# Altium project PCEIOT - V1.1.0.PrjPcb (part 2 of 2)

## Sheet [7] PowerManagement.SchDoc: =DocumentName
size A3; ENG_APP_DATE: --/--/--; DSN_APP_DATE: --/--/--; CHK_APP_DATE: --/--/--; Organization: ORGANIZATION; Address1: R. Aprígio Veloso, 882, Universitário; Address2: Campina Grande - PB; Address3: 58429-900; DocumentNumber: 7; Revision: -; SheetNumber: 7; SheetTotal: 9; Project: PCEIOT - V1.1.0.PrjPcb; ENG_DATE: --/--/--; DSN_DATE: --/--/--; CHK_DATE: --/--/--; SCH_SCALE: 1:1
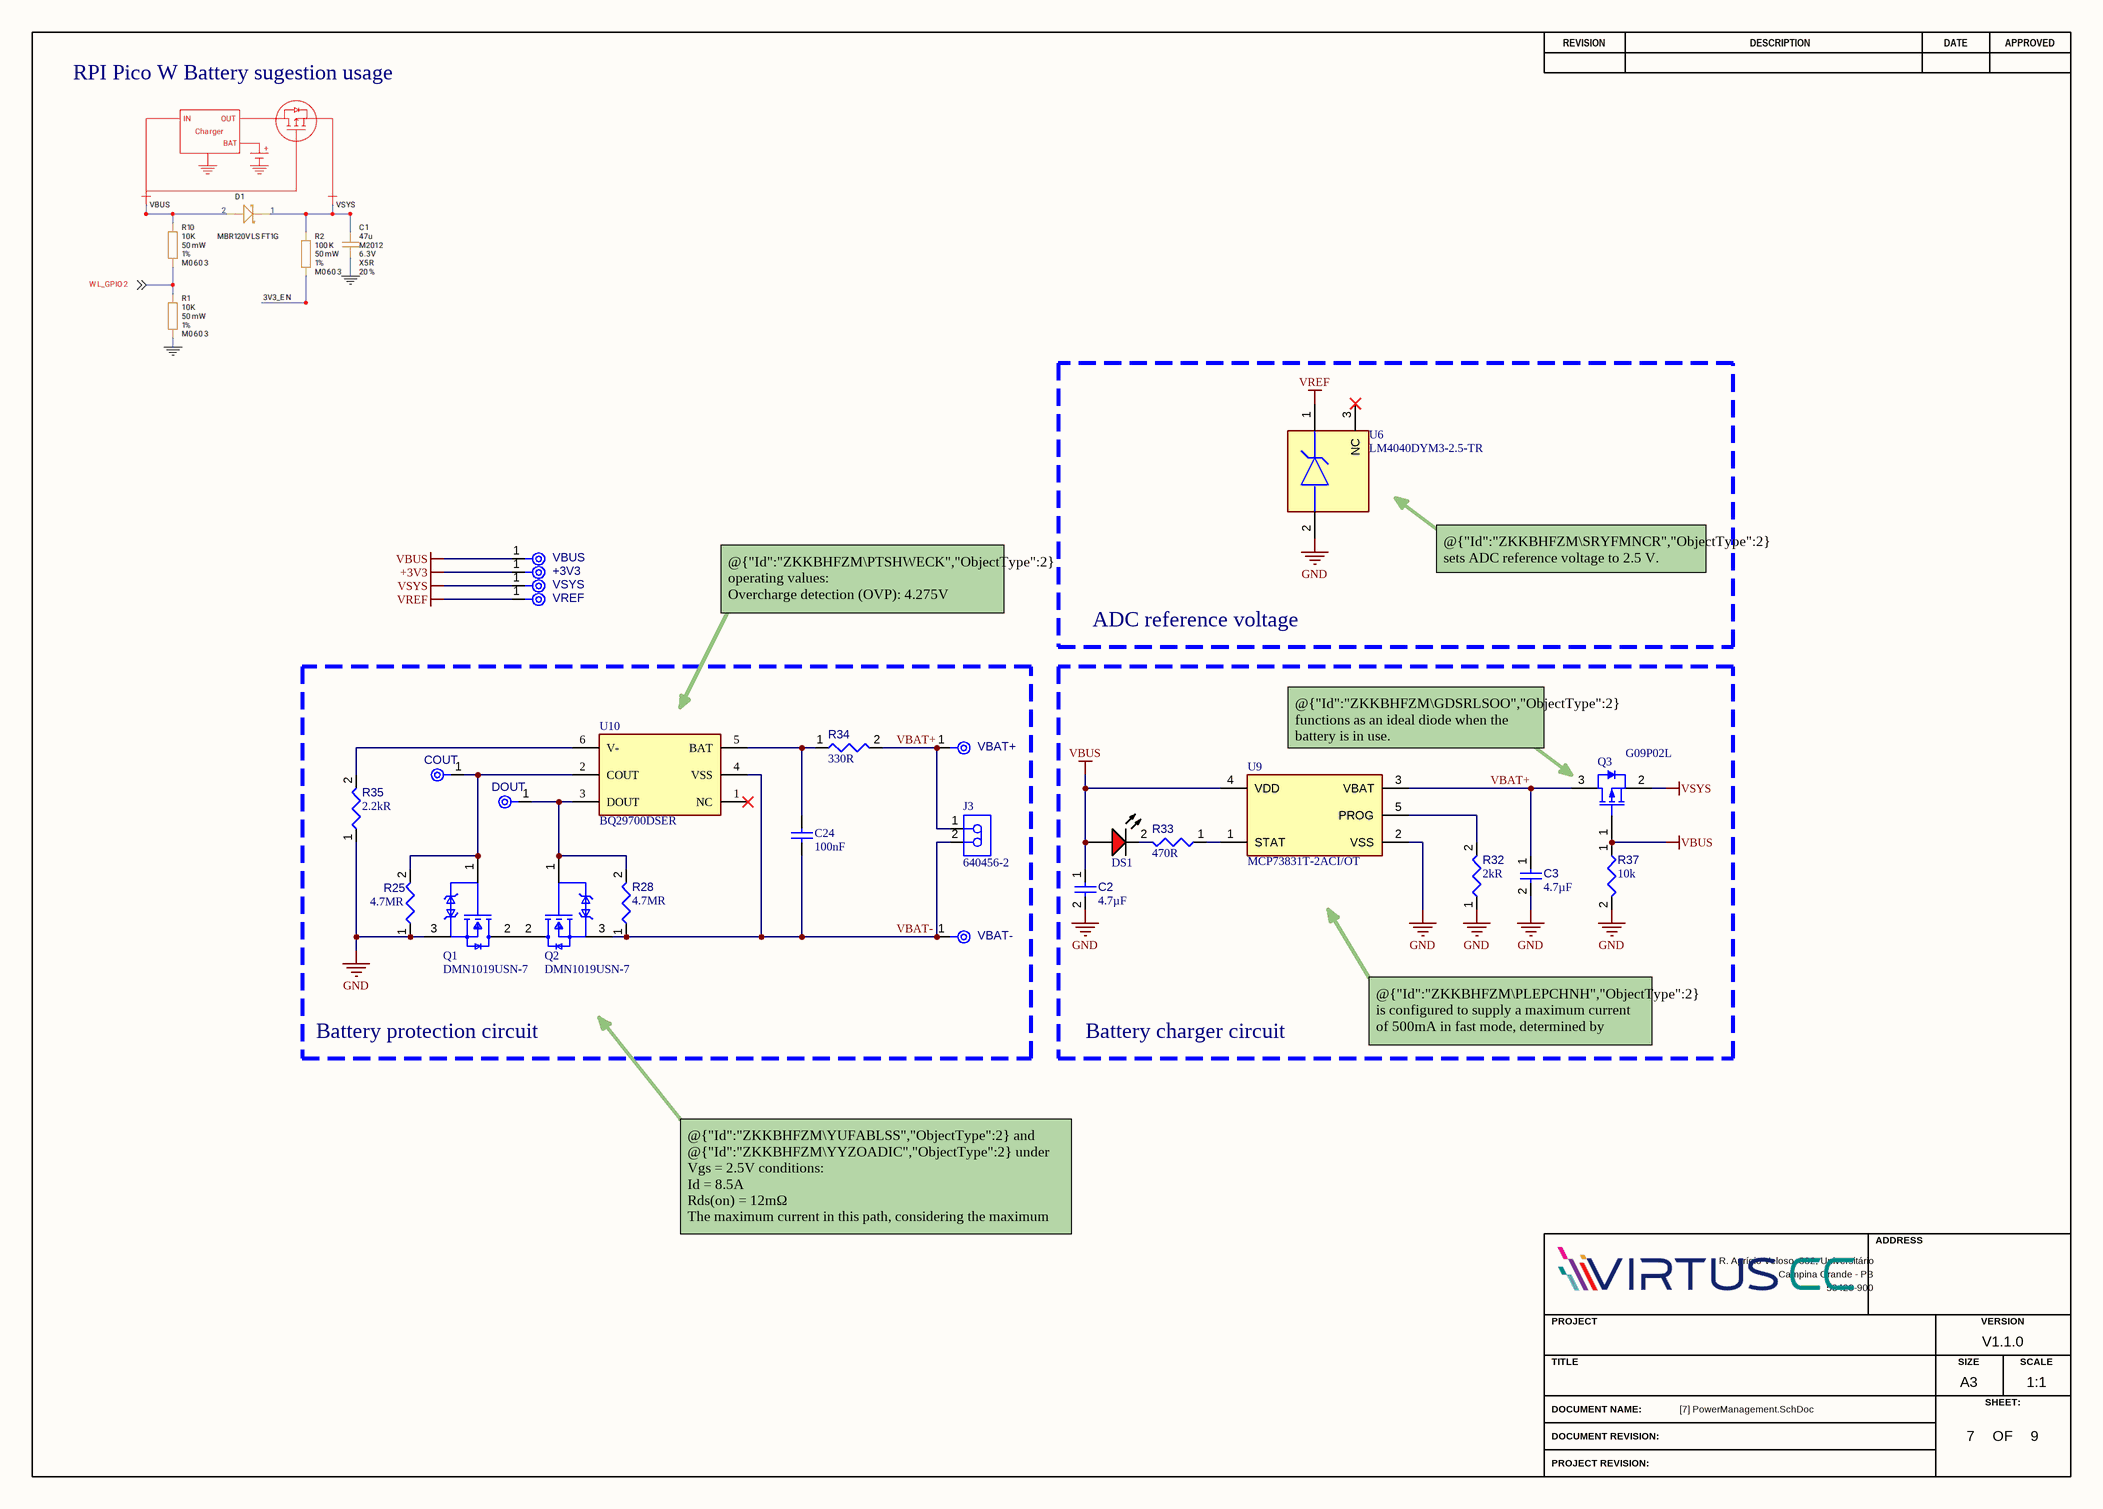
[diagram p5: [7] PowerManagement.SchDoc]

### Parts
+3V3  TPAD6R  [TP06R]  (value not drawn)  (no BOM)
C2  value 4.7µF  [CAPC0603(1608)100_L]  (hidden comment: Capacitor 4.7µF +/-20% 10V 0603)
C3  value 4.7µF  [CAPC0603(1608)100_L]  (hidden comment: Capacitor 4.7µF +/-20% 10V 0603)
C24  value 100nF  [CAPC0603(1608)100_L]  (hidden comment: VJ0603Y104MXJCW1BC)
COUT  TPAD6R  [TP06R]  (value not drawn)  (no BOM)
DOUT  TPAD6R  [TP06R]  (value not drawn)  (no BOM)
DS1  19-217/R6C-AL1M2VY/3T  [EVRL-0603-2_V]  (value not drawn)
J3  640456-2  [TECO-640456-2_V]
Q1  DMN1019USN-7  [FP-SC59-MFG]
Q2  DMN1019USN-7  [FP-SC59-MFG]
Q3  G09P02L  [G09P02L]
R25  value 4.7MR  [RESC0603(1608)_L]  (hidden comment: ERJ-3GEYJ475V)
R28  value 4.7MR  [RESC0603(1608)_L]  (hidden comment: ERJ-3GEYJ475V)
R32  value 2kR  [RESC0603(1608)_L]  (hidden comment: ERJ-3EKF2001V)
R33  value 470R  [RESC0603(1608)_L]  (hidden comment: CRCW0603470RJNEA)
R34  value 330R  [RESC0603(1608)_L]  (hidden comment: ERJ-3EKF3300V)
R35  value 2.2kR  [RESC0603(1608)_L]  (hidden comment: CRCW06032K20FKEA)
R37  value 10k  [RESC0603(1608)_L]  (hidden comment: Resistor 10k +/-1% 0603 100 mW)
U6  LM4040DYM3-2.5-TR  [FP-SOT23-3LD-PL-1-IPC_A]
U9  MCP73831T-2ACI/OT  [FP-C04-091-OT-MFG]
U10  BQ29700DSER  [FP-DSE0006A-MFG]
VBAT+  TPAD6R  [TP06R]  (value not drawn)  (no BOM)
VBAT-  TPAD6R  [TP06R]  (value not drawn)  (no BOM)
VBUS  TPAD6R  [TP06R]  (value not drawn)  (no BOM)
VREF  TPAD6R  [TP06R]  (value not drawn)  (no BOM)
VSYS  TPAD6R  [TP06R]  (value not drawn)  (no BOM)

### Blocks framed on the sheet
ADC reference voltage: U6
Battery protection circuit: C24 COUT DOUT J3 Q1 Q2 R25 R28 R34 R35 U10 VBAT+ VBAT-
Battery charger circuit: C2 C3 DS1 Q3 R32 R33 R37 U9

### Nets
+3V3: +3V3.1(TP)
GND: C2.2 C3.2 Q1.3(D) R25.1 R32.1 R35.1 R37.2 U6.2(-) U9.2(VSS)
VBUS: C2.1 DS1.1(A) Q3.1(G) R37.1 U9.4(VDD) VBUS.1(TP)
VREF: U6.1(+) VREF.1(TP)
VSYS: Q3.2(S) VSYS.1(TP)
VBAT+: C3.1 J3.1 Q3.3(D) R34.2 U9.3(VBAT) VBAT+.1(TP)
VBAT-: C24.1 J3.2 Q2.3(D) R28.1 U10.4(VSS) VBAT-.1(TP)
NetC24_2: C24.2 R34.1 U10.5(BAT)
NetCOUT_1: COUT.1(TP) Q1.1(G) R25.2 U10.2(COUT)
NetDOUT_1: DOUT.1(TP) Q2.1(G) R28.2 U10.3(DOUT)
NetDS1_2: DS1.2(K) R33.2
NetQ1_2: Q1.2(S) Q2.2(S)
NetR32_2: R32.2 U9.5(PROG)
NetR33_1: R33.1 U9.1(STAT)
NetR35_2: R35.2 U10.6(V-)

Not connected (* = marked no-connect by the designer): U6 3(NC)*; U10 1(NC)*

### Notes on the sheet
- RPI Pico W Battery sugestion usage
- @{"Id":"ZKKBHFZM\SRYFMNCR","ObjectType":2} sets ADC reference voltage to 2.5 V.
- @{"Id":"ZKKBHFZM\PTSHWECK","ObjectType":2} operating values:
  Overcharge detection (OVP): 4.275V
  Over-discharge detection (UVP): 2.800V
- (near U9) @{"Id":"ZKKBHFZM\GDSRLSOO","ObjectType":2} functions as an ideal diode when the battery is in use.
- @{"Id":"ZKKBHFZM\PLEPCHNH","ObjectType":2} is configured to supply a maximum current of 500mA in fast mode, determined by @{"Id":"ZKKBHFZM\ESMCSCBA","ObjectType":2}.
- @{"Id":"ZKKBHFZM\YUFABLSS","ObjectType":2} and @{"Id":"ZKKBHFZM\YYZOADIC","ObjectType":2} under Vgs = 2.5V conditions:
  Id = 8.5A
  Rds(on) = 12mΩ
  The maximum current in this path, considering the maximum power output of the DC-DC converter in the Raspberry Pi Pico W, is approximately 3.6A.
- REVISION
- DESCRIPTION
- DATE
- APPROVED
- ADDRESS
- PROJECT
- VERSION
- TITLE
- A3
- SIZE
- SCALE
- DOCUMENT NAME:
- DOCUMENT REVISION:
- OF
- SHEET:
- PROJECT REVISION:

### Library data of the parts
+3V3 COUT DOUT VBAT+ VBAT- VBUS VREF VSYS = CMP-00028-00002-2: 0.6mm round; Pins: 1
C2 C3 = CMP-001-00076-4: Chip Capacitor, 4.7µF +/-20%, 10V, 0603, Thickness 1 mm; Tolerance: 10%; Mounting Technology: SMT; Case/Package: 0603; Pins: 2; Min Operating Temperature: -55°C; Max Operating Temperature: 85°C; Voltage Rating: 10V
C24 = CMP-001-00085-1: Multilayer Ceramic Capacitor, 0.1 uF, 16 V, ± 20%, X7R, 0603 [1608 Metric]; Dielectric Material: Tantalum; Voltage Rating: 16V; Packaging: Tape and Reel; Min Operating Temperature: -55°C; Case/Package: 0603; Length: 1.6mm; Termination: SMD/SMT; Height: 0.95mm; Mounting Technology: Surface Mount; Width: 0.8mm; Case Code (Imperial): 0603; Construction: Flat; Lead Free: Lead Free; Package Quantity: 4000; Max Operating Temperature: 125°C; Dielectric: X7R; RoHS Compliant: Yes; Depth: 0.8mm; Tolerance: 20%; Series: VJ; Case Code (Metric): 1608; Voltage Rating (DC): 16V
DS1 = CMP-007-00004-2: Chip LED, Red, 5 V, 25 mA, -40 to 85 degC, 2-Pin SMD (0603), RoHS, Tape and Reel; Manufacturer: Everlight Electronics; Forward Voltage: 2.2V; Lens Style: Clear; Package Reference: 0603; Datasheet Version: Rev. 1, 01/2005; Mounting Technology: SM; RoHS Compliant: False; Datasheet URL: https://datasheet.ciiva.com/4688/el-19-217-r6c-al1m2vy-3tpdf-187026-4688713.pdf; Case/Package: 0603; Colour: Red; Manufacturer URL: http://www.everlight.com/; Package Description: 2-Pin Surface Mount Device, Body 1.6 x 0.8 mm
J3 = CMP-002-00073-1: Connector 250V AC/DC 5A 2P 1 Row PCB - Vertical Mounting Polyester White; Contact Retention: No (Without); PCB Thickness: 0.063inch; Approvals: CSA; Contact Post Length: 3.56mm; Gender: Male; Circuit Application: Signal; Tail Length: 0.14inch; Plating Thickness: 3.81um; Plating: Tin; Mating Connector Lock: Yes (With); PCB Mount Retention: Without; Contact Style: Straight; Number of Positions: 2; Connector System: Wire-to-Board; Pitch: 2.54mm; Connector Type: Connector,Pin,Plug,Header; Voltage Rating: 250V; Termination: Solder; Contact Current Rating: 5A; PCB Mount Alignment: No (Without); Housing Material: Polyester; Contact Material: Copper Alloy; Current Rating: 5A; Mounting Ears: No (Without); Strain Relief: No (Without); Shrouded: No (Without); Min Operating Temperature: -67°C; Orientation: Straight; Series: MTA-100; Panel Mount Retention: No (Without); Package Quantity: 5000; Height: 7.87mm; Length: 7.62mm; PCB Mounting Orientation: Vertical; Flammability Rating: UL94 V-0; Operating Supply Voltage: 250V; Contact Plating: Tin; Mounting Technology: Through Hole; Voltage Rating (AC): 250V; Backwall/Post Interruptions: No (Without); Contact Mating Length: 7.49mm; Color: Beige; Voltage Rating (DC): 250V; Lead Free: Lead Free; Reach SVHC Compliant: Unknown; Sealable: No (Without); Mating Alignment: No (Without); Mating Retention: No (Without); Number of Contacts: 2; Contact Shape: Square; Max Operating Temperature: 221°C; Number of Rows: 1; RoHS Compliant: Yes; Housing Color: Natural
Q1 Q2 = CMP-013-00035-1: N-Channel 12 V 10 mO 50.6 nC SMT Enhancement Mode Mosfet - SC-59 (SOT-23); Gate to Source Voltage (Vgs): 4.5V; Max Power Dissipation: 680mW; Number of Channels: 1; Rds On Max: 10mR; Input Capacitance: 2.426nF; Turn-On Delay Time: 7.6ns; Value: 2.426E-09F; Rise Time: 57.6ns; Fall Time: 16.8ns; Drain to Source Resistance: 41mR; Turn-Off Delay Time: 22.2ns; Continuous Drain Current (ID): 9.3A; Drain to Source Voltage (Vdss): 12V; RoHS Compliant: Yes; Min Operating Temperature: -55°C; Series: -; Max Operating Temperature: 150°C; Lead Free: Lead Free; Weight: 0.000282oz; Package Quantity: 3000; Polarity: N-CHANNEL; Packaging: Tape and Reel; Case/Package: TO-236-3; Mounting Technology: Surface Mount
Q3 = CMP-013-00036-1: P-Channel Enhancement Mode Power MOSFET; Rds On (Max) @ Id, Vgs: 20mOhm @ 1A, 4.5V; Drain to Source Voltage (Vdss): 20 V; Vgs (Max): ±12V; Drive Voltage (Max Rds On, Min Rds On): 2.5V, 4.5V; Current - Continuous Drain (Id) @ 25°C: 9A (Tc); FET Type: P-Channel
R25 R28 = CMP-009-00185-1: Res Thick Film 0603 4.7M Ohm 5% 0.1W -400ppm/°C to 150ppm/°C Molded SMD Punched Carrier T/R; Voltage Rating (DC): 50V; Max Power Dissipation: 100mW; Voltage Rating: 75V; Min Operating Temperature: -55°C; Reach SVHC Compliant: Unknown; Resistance Tolerance: 5%; Contact Plating: Tin; Military Standard: Not; RoHS Compliant: Yes; Tolerance: 5%; Depth: 0.8mm; Case/Package: 0603; Number of Terminations: 2; Width: 0.8mm; Lead Free: Lead Free; Case Code (Metric): 1608; Construction: Rectangular; Series: ERJ; Features: Automotive AEC-Q200; Length: 1.6mm; Power Rating: 100mW; Weight: 7.1E-05oz; Termination: SMD/SMT; Height: 0.45mm; Resistor Type: Thick Film; Case Code (Imperial): 0603; Packaging: Tape and Reel; Mounting Technology: Surface Mount; Temperature Coefficient: 150ppm/°C; Package Quantity: 1; Technology: THICK FILM; Max Operating Temperature: 155°C
R32 = CMP-009-00181-1: SMD Chip Resistor, 2 kOhm, ï¿½ 1%, 100 mW, 0603 [1608 Metric], Thick Film, Precision; Power Rating: 100mW; Temperature Coefficient: 100ppm/°C; Voltage Rating: 75V; Voltage Rating (DC): 50V; Construction: Rectangular; Tolerance: 1%; Case Code (Imperial): 0603; Contact Plating: Tin; Packaging: Tape and Reel; Width: 0.8mm; Length: 1.6mm; Lead Free: Lead Free; Max Operating Temperature: 155°C; Number of Terminations: 2; Features: Automotive AEC-Q200; Min Operating Temperature: -55°C; Termination: SMD/SMT; Case/Package: 0603; Max Power Dissipation: 100mW; Reach SVHC Compliant: No; Radiation Hardening: No; RoHS Compliant: Yes; Resistance Tolerance: 1%; Pins: 2; Series: ERJ; Case Code (Metric): 1608; Mounting Technology: Surface Mount; Height: 0.022inch; Military Standard: Not; Depth: 0.8mm; Package Quantity: 1; Resistor Type: Thick Film
R33 = CMP-009-00182-1: Res Thick Film 0603 470 Ohm 5% 0.1W(1/10W) ±200ppm/°C Pad SMD Automotive T/R; Max Power Dissipation: 100mW; Working Voltage: 75V; Case Code (Metric): 1608; Case Code (Imperial): 0603; Width: 0.85mm; Series: CRCW; Max Operating Temperature: 155°C; Features: Automotive AEC-Q200; Height: 0.45mm; Technology: THICK FILM; Power Rating: 100mW; Depth: 0.85mm; Min Operating Temperature: -55°C; Weight: 7.1E-05oz; RoHS Compliant: Yes; Number of Terminations: 2; Voltage Rating: 75V; Ratings: AEC-Q200; Case/Package: 0603; Contact Plating: Tin; Radiation Hardening: No; Termination: SMD/SMT; Tolerance: 5%; Construction: Rectangular; Package Quantity: 5000; Reach SVHC Compliant: Unknown; Length: 1.55mm; Resistor Type: Thick Film; Lead Free: Lead Free; Temperature Coefficient: 200ppm/°C; Resistance Tolerance: 5%; Packaging: Tape and Reel; Military Standard: Not
R34 = CMP-009-00184-1: SMD Chip Resistor, 330 Ohm, ± 1%, 100 mW, 0603 [1608 Metric], Thick Film, Precision; Current Rating: 500mA; Voltage Rating (DC): 75V; Power Rating: 100mW; Gender: Male; Temperature Coefficient: 100ppm/°C; Termination: SMD/SMT; Construction: Rectangular; Contact Plating: Tin; Resistor Type: Thick Film; Features: Automotive AEC-Q200; Max Operating Temperature: 155°C; Weight: 7.1E-05oz; Package Quantity: 5000; Lead Pitch: 1.1mm; Radiation Hardening: No; Lead Free: Lead Free; Min Operating Temperature: -55°C; Reach SVHC Compliant: No; Pins: 2; Number of Terminations: 2; Width: 0.8mm; RoHS Compliant: Yes; Depth: 0.8mm; Packaging: Tape and Reel; Voltage Rating: 75V; Mounting Technology: Surface Mount; Case Code (Metric): 1608; Resistance Tolerance: 1%; Tolerance: 1%; Case Code (Imperial): 0603; Length: 1.6mm; Height: 0.45mm; Military Standard: Not; Series: ERJ; Max Power Dissipation: 100mW; Case/Package: 0603; Contact Material: Copper
R35 = CMP-009-00186-1: SMD Chip Resistor, 2.2 kOhm, ± 1%, 100 mW, 0603 [1608 Metric], Thick Film, General Purpose; Voltage Rating (DC): 75V; Max Power Dissipation: 100mW; Temperature Coefficient: 100ppm/°C; Depth: 0.85mm; Height: 0.45mm; Contact Plating: Tin; Resistance Tolerance: 1%; Ratings: AEC-Q200; Weight: 7.1E-05oz; Series: CRCW; Case Code (Imperial): 0603; Construction: Rectangular; Width: 0.033inch; Reach SVHC Compliant: Unknown; Case Code (Metric): 1608; Resistor Type: Thick Film; Packaging: Tape and Reel; Case/Package: 0603; Package Quantity: 10; RoHS Compliant: Yes; Lead Free: Lead Free; Military Standard: Not; Termination: SMD/SMT; Tolerance: 1%; Technology: THICK FILM; Max Operating Temperature: 155°C; Voltage Rating: 75V; Power Rating: 100mW; Length: 1.55mm; Number of Terminations: 2; Radiation Hardening: No; Min Operating Temperature: -55°C; Features: Automotive AEC-Q200
R37 = CMP-009-00017-7: Chip Resistor, 10 KOhm, +/- 1%, 01 W, -55 to 155 degC, 0603 (1608 Metric); Voltage Rating: 50V; Power: 100mW; RoHS Compliant: True; Min Operating Temperature: -55°C; Pins: 2; Case/Package: 0603; Mounting Technology: SM; Max Operating Temperature: 155°C; Tolerance: 1%
U6 = CMP-004-00033-1: LM4040 Series 2.5 V ±1 % Precision Micropower Shunt Voltage Reference - SOT-23; Output Type: Fixed; Output Voltage: 10V; Max Output Voltage: 2.5V; Cathode Current: 70uA; Temperature Coefficient: 150ppm/°C; Output Current: 15mA; Tolerance: 1%; Supply Current: 500nA; Height: 1.01mm; Reference Type: Shunt; Lead Free: Lead Free; Max Operating Temperature: 85°C; Series: -; Min Output Voltage: 2.5V; Length: 2.92mm; Current Rating: 15mA; Pins: 3; Package Quantity: 3000; Max Output current: 15mA; Min Operating Temperature: -40°C; Packaging: Tape and Reel; Width: 1.3mm; Radiation Hardening: No; Case/Package: SOT-23; Reach SVHC Compliant: No; Reference Voltage: 2.5V; RoHS Compliant: Yes; Mounting Technology: Surface Mount
U9 = CMP-001-0001-1: MCP73831 Series Single-Cell Li-Ion/Li-Polymer Battery Charge Controller SOT-23-5; Output Voltage: 4.2V; Number of Channels: 1; Fault Protection: Over Voltage; Min Supply Voltage: 3.75V; Max Supply Voltage: 6V; Max Power Dissipation: 1.54W; Output Current: 500mA; Voltage Rating: 4.534V; Drain to Source Resistance: 350mR; Min Output Voltage: 4.168V; Max Output Voltage: 4.5V; Mounting Technology: Surface Mount; Number of Outputs: 1; RoHS Compliant: Yes; Weight: 0.00709oz; Length: 3.1mm; Max Operating Temperature: 85°C; Series: -; Case/Package: SOT-23; Radiation Hardening: No; Pins: 5; Packaging: Tape and Reel; Lead Free: Lead Free; Number of Cells: 1; Width: 1.8mm; Height: 1.3mm; Max Charge Current: 500mA; Battery Pack Voltage: 4.2V; Reach SVHC Compliant: No; Termination: SMD/SMT; Min Operating Temperature: -40°C
U10 = CMP-001-0002-1: Li-Ion/Li Polymer Advanced Single-Cell Battery Protector IC Family 6-WSON -40 to 85; Fault Protection: Over Current,Short Circuit,Over/Under Voltage; Operating Supply Voltage: 8V; Number of Cells: 1; Case/Package: WFDFN; Lead Free: Lead Free; Pins: 6; Height: 800um; Packaging: Tape and Reel; Max Operating Temperature: 85°C; Weight: 0.000342oz; Mounting Technology: Surface Mount; Series: -; Contact Plating: Gold; Thickness: 750um; RoHS Compliant: Yes; Package Quantity: 3000; Width: 1.5mm; Length: 1.5mm; Min Operating Temperature: -40°C

## Sheet [9] Mechanical.SchDoc: =DocumentName
size A3; ENG_APP_DATE: --/--/--; DSN_APP_DATE: --/--/--; CHK_APP_DATE: --/--/--; Organization: ORGANIZATION; Address1: R. Aprígio Veloso, 882, Universitário; Address2: Campina Grande - PB; Address3: 58429-900; DocumentNumber: 9; Revision: -; SheetNumber: 9; SheetTotal: 9; Project: PCEIOT - V1.1.0.PrjPcb; ENG_DATE: --/--/--; DSN_DATE: --/--/--; CHK_DATE: --/--/--; SCH_SCALE: 1:1
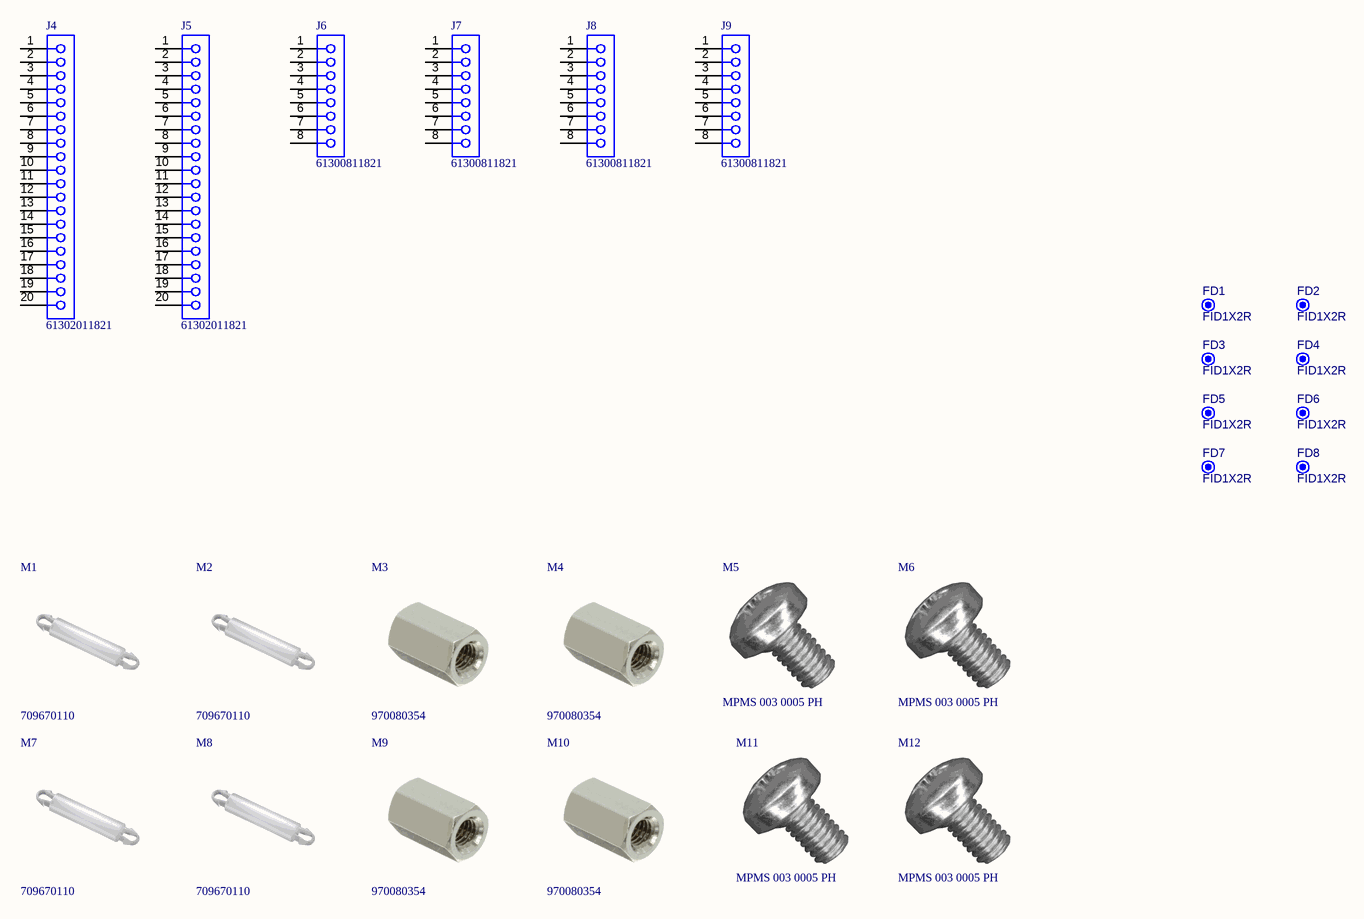
[diagram p6: [9] Mechanical.SchDoc]

### Parts
FD1  FID1X2R  [FID1X2R]  (no BOM)
FD2  FID1X2R  [FID1X2R]  (no BOM)
FD3  FID1X2R  [FID1X2R]  (no BOM)
FD4  FID1X2R  [FID1X2R]  (no BOM)
FD5  FID1X2R  [FID1X2R]  (no BOM)
FD6  FID1X2R  [FID1X2R]  (no BOM)
FD7  FID1X2R  [FID1X2R]  (no BOM)
FD8  FID1X2R  [FID1X2R]  (no BOM)
J4  61302011821  [61302011821]  (mechanical)
J5  61302011821  [61302011821]  (mechanical)
J6  61300811821  [61300811821]  (mechanical)
J7  61300811821  [61300811821]  (mechanical)
J8  61300811821  [61300811821]  (mechanical)
J9  61300811821  [61300811821]  (mechanical)
M1  709670110  (mechanical)
M2  709670110  (mechanical)
M3  970080354  (mechanical)
M4  970080354  (mechanical)
M5  MPMS 003 0005 PH  (mechanical)
M6  MPMS 003 0005 PH  (mechanical)
M7  709670110  (mechanical)
M8  709670110  (mechanical)
M9  970080354  (mechanical)
M10  970080354  (mechanical)
M11  MPMS 003 0005 PH  (mechanical)
M12  MPMS 003 0005 PH  (mechanical)

### Nets

Not connected (* = marked no-connect by the designer): J4 1 2 3 4 5 6 7 8 9 10 11 12 13 14 15 16 17 18 19 20; J5 1 2 3 4 5 6 7 8 9 10 11 12 13 14 15 16 17 18 19 20; J6 1 2 3 4 5 6 7 8; J7 1 2 3 4 5 6 7 8; J8 1 2 3 4 5 6 7 8; J9 1 2 3 4 5 6 7 8

### Notes on the sheet
- REVISION
- DESCRIPTION
- DATE
- APPROVED
- ADDRESS
- PROJECT
- VERSION
- TITLE
- A3
- SIZE
- SCALE
- DOCUMENT NAME:
- DOCUMENT REVISION:
- OF
- SHEET:
- PROJECT REVISION:

### Library data of the parts
FD1-FD8 = CMP-00028-00005-5: Fiducial - Round 1x2mm; Pins: 0
J4 J5 = CMP-002-00074-1: THT Vertical Socket Header WR-PHD, Pitch 2.54 mm, Single Row, 20 pins; Contact Resistance: 20mR; Operating Supply Voltage: 250V; Current Rating: 3A; Gender: Female; Orientation: Vertical; Pins: 20; Lead Pitch: 2.54mm; RoHS Compliant: Yes
J6-J9 = CMP-002-00075-1: Btb Conn, Rcpt, 8Pos, 1Row, 2.54Mm Rohs Compliant: Yes; Operating Supply Voltage: 250V; Gender: Female; Contact Resistance: 20mR; Current Rating: 3A; Pins: 8; Lead Pitch: 2.54mm; Orientation: Vertical; RoHS Compliant: Yes
M1 M2 M7 M8 = CMP-00028-00009-2: Pcb Mounting, Nylon 6.6, 11Mm Rohs Compliant: Yes; Material: Nylon; Series: WA-SNSN
M3 M4 M9 M10 = CMP-00028-00008-4: WA-SBRII Brass Spacer Stud Metric Thread int./int.; Plating: Nickel; Thread Size: M3; Gender: Female, Female; Threaded/Unthreaded: Threaded; Material: Brass; Series: WA-SBRII; Color: Silver
M5 M6 M11 M12 = CMP-00028-00007-2: Mach Screw Pan Head Phillips M3; Lead Free: Contains Lead

## Sheet [2] BlockDiagram.SchDoc: =DocumentName
size A3; ENG_APP_DATE: --/--/--; DSN_APP_DATE: --/--/--; CHK_APP_DATE: --/--/--; Organization: ORGANIZATION; Address1: R. Aprígio Veloso, 882, Universitário; Address2: Campina Grande - PB; Address3: 58429-900; DocumentNumber: 2; Revision: -; SheetNumber: 2; SheetTotal: 9; Project: PCEIOT - V1.1.0.PrjPcb; ENG_DATE: --/--/--; DSN_DATE: --/--/--; CHK_DATE: --/--/--; SCH_SCALE: 1:1
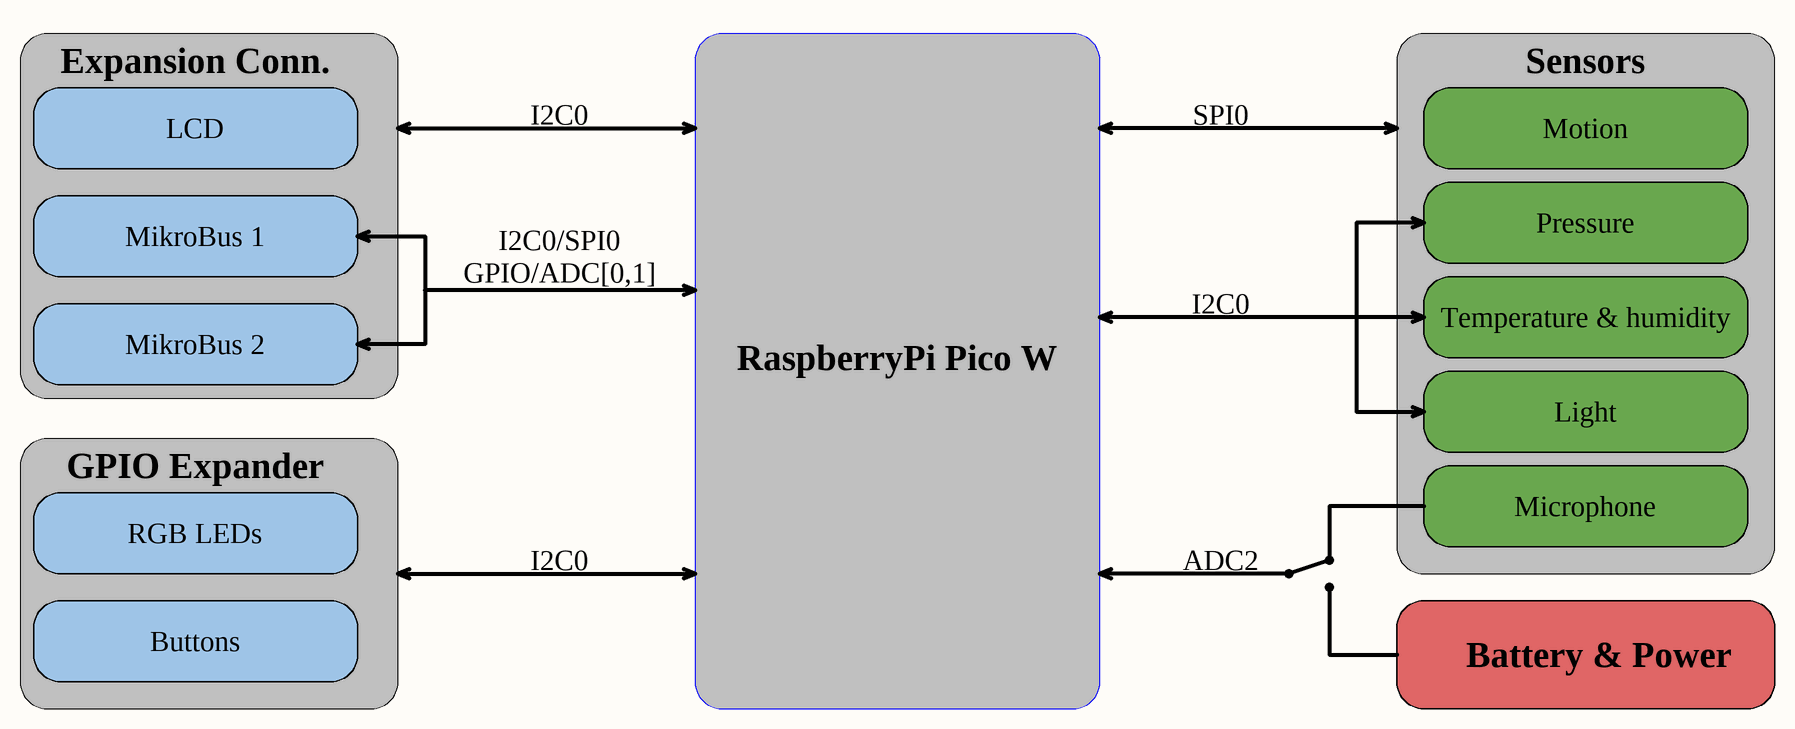
[diagram p7: [2] BlockDiagram.SchDoc]

### Notes on the sheet
- Expansion Conn.
- I2C0
- SPI0
- Sensors
- LCD
- Motion
- MikroBus 1
- Pressure
- MikroBus 2
- I2C0/SPI0
  GPIO/ADC[0,1]
- RaspberryPi Pico W
- Temperature & humidity
- Light
- GPIO Expander
- Microphone
- RGB LEDs
- ADC2
- Buttons
- Battery & Power
- REVISION
- DESCRIPTION
- DATE
- APPROVED
- ADDRESS
- PROJECT
- VERSION
- TITLE
- A3
- SIZE
- SCALE
- DOCUMENT NAME:
- DOCUMENT REVISION:
- OF
- SHEET:
- PROJECT REVISION:

## Sheet [1] TableOfContents.SchDoc: =DocumentName
size A3; ENG_APP_DATE: --/--/--; DSN_APP_DATE: --/--/--; CHK_APP_DATE: --/--/--; Organization: ORGANIZATION; Address1: R. Aprígio Veloso, 882, Universitário; Address2: Campina Grande - PB; Address3: 58429-900; DocumentNumber: 1; Revision: -; SheetNumber: 1; SheetTotal: 9; Project: PCEIOT - V1.1.0.PrjPcb; ENG_DATE: --/--/--; DSN_DATE: --/--/--; CHK_DATE: --/--/--; SCH_SCALE: 1:1
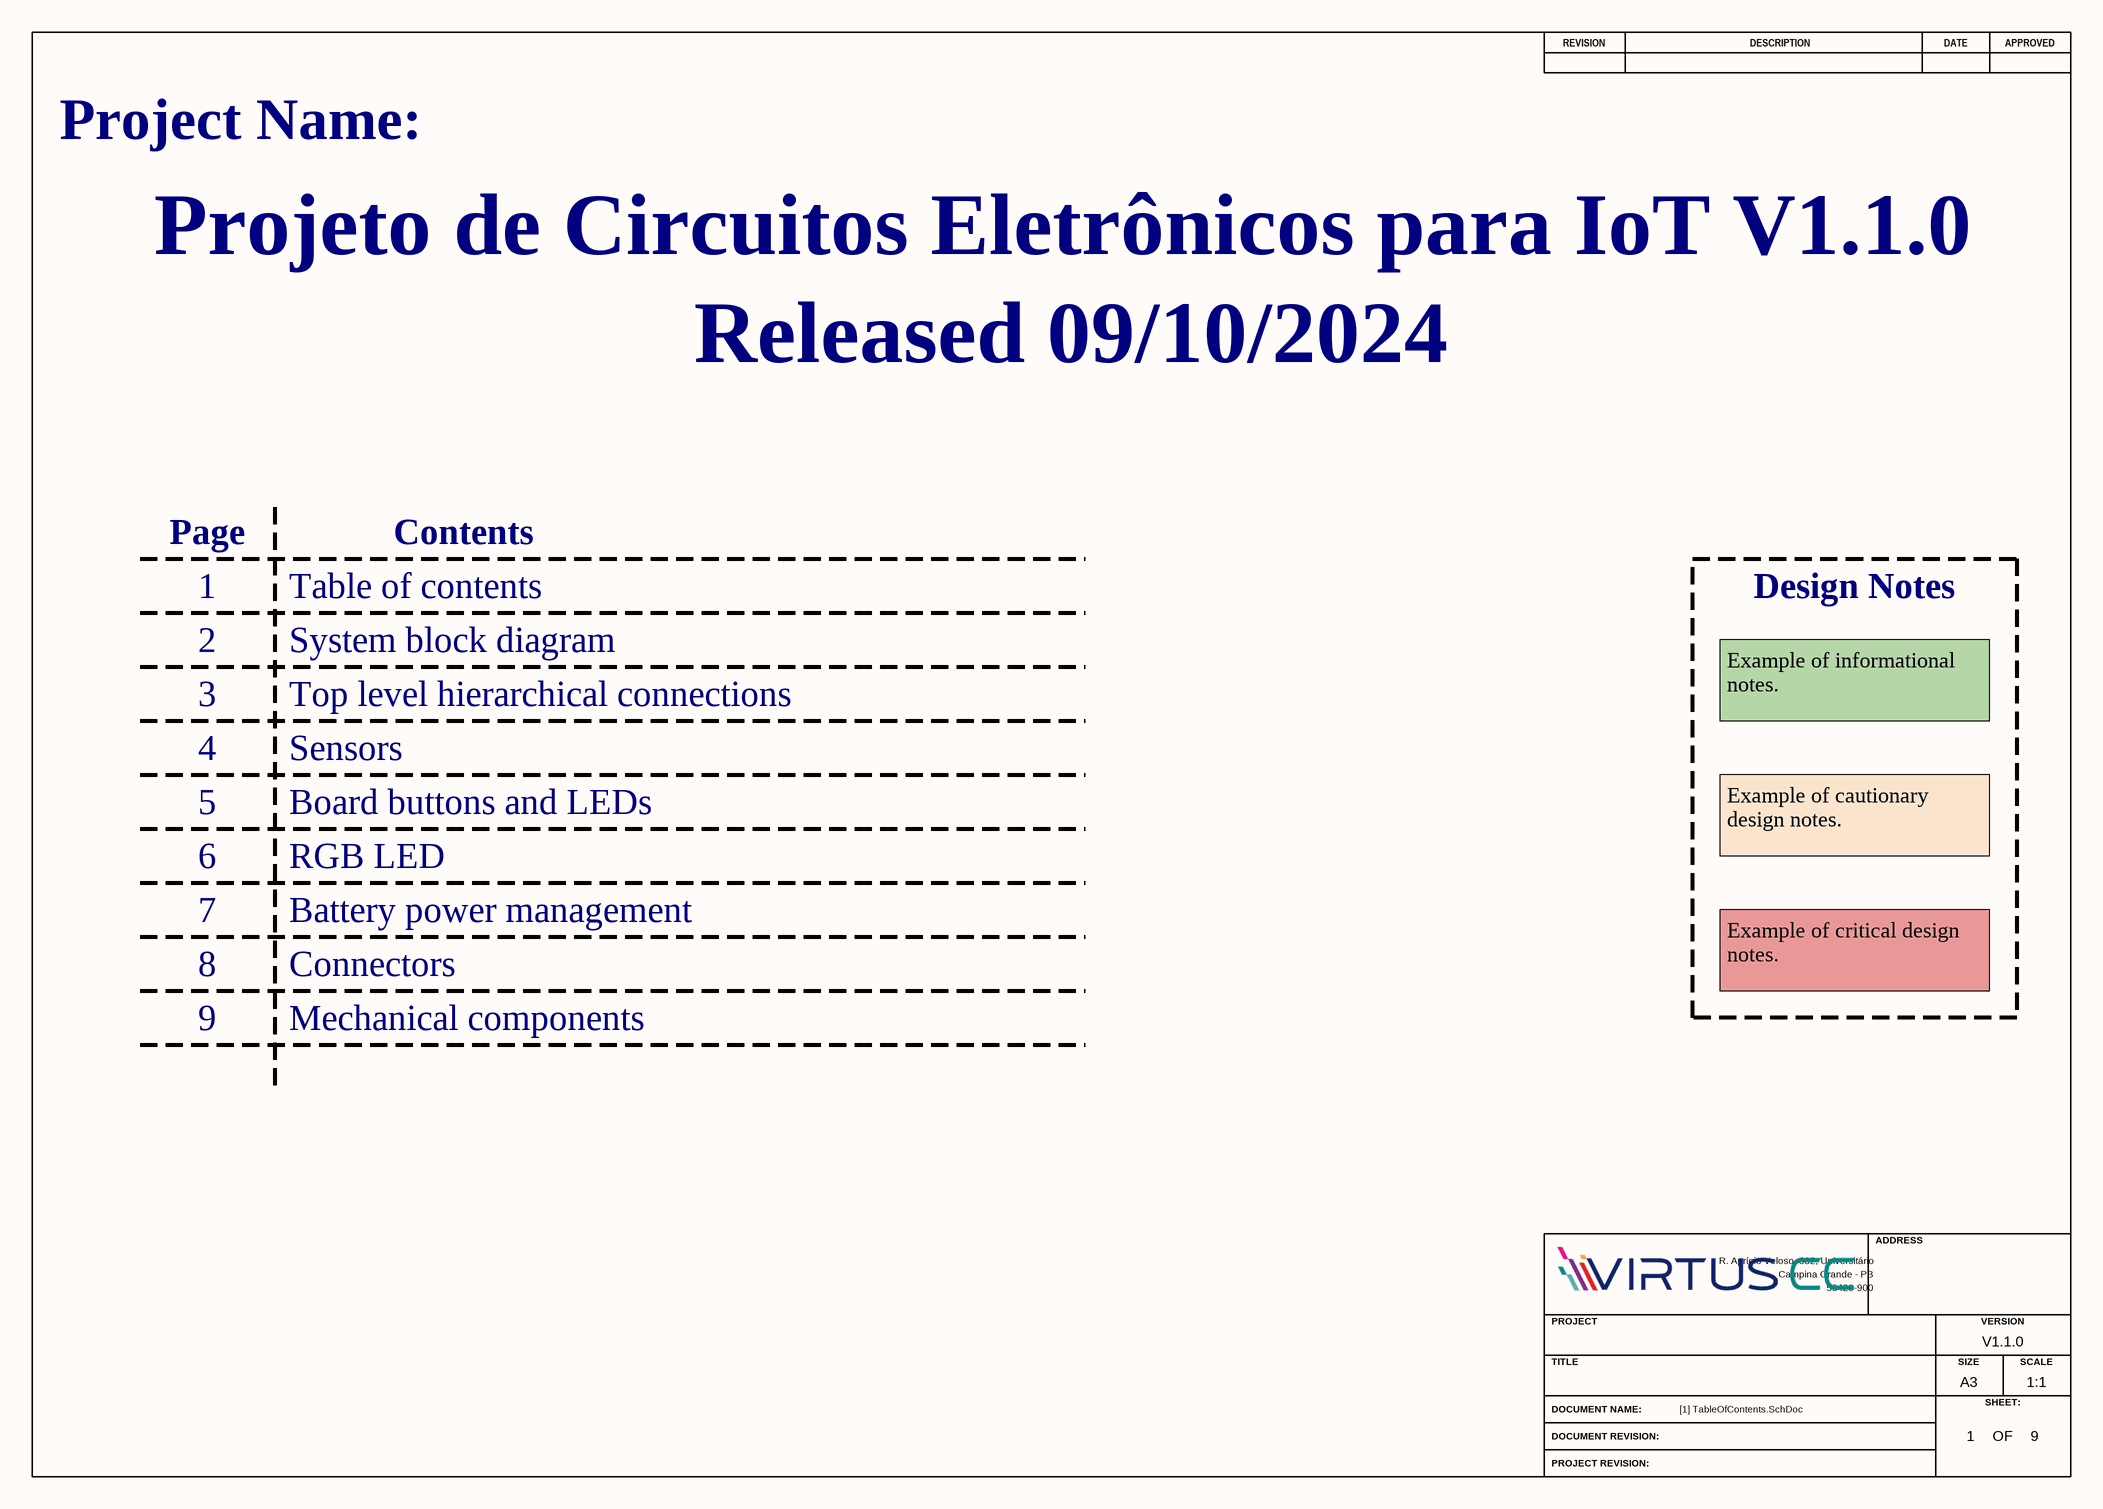
[diagram p8: [1] TableOfContents.SchDoc]

### Notes on the sheet
- Project Name:
- Released 09/10/2024
- 1
- Page
- Table of contents
- Contents
- Design Notes
- 2
- System block diagram
- 3
- Top level hierarchical connections
- Example of informational notes.
- 4
- Sensors
- 5
- 6
- Board buttons and LEDs
- RGB LED
- Example of cautionary
  design notes.
- 7
- Battery power management
- 8
- Connectors
- Example of critical design notes.
- 9
- Mechanical components
- REVISION
- DESCRIPTION
- DATE
- APPROVED
- ADDRESS
- PROJECT
- VERSION
- TITLE
- A3
- SIZE
- SCALE
- DOCUMENT NAME:
- DOCUMENT REVISION:
- OF
- SHEET:
- PROJECT REVISION:

## Nets that join several sheets
+3V3: [3] TopLevel (R22.2 R23.2 U7.36), [5] ButtonsAndLEDs (13 pins), Buttons & LEDs/"RGB_LEDs"1 (D2A.4 D2A.5 D2A.6), Buttons & LEDs/"RGB_LEDs"2 (D2B.4 D2B.5 D2B.6), Buttons & LEDs/"RGB_LEDs"3 (D2C.4 D2C.5 D2C.6), [8] Conectors (14 pins), [4] Sensors (14 pins), [7] PowerManagement (+3V3.1)
GND: [3] TopLevel (17 pins), [5] ButtonsAndLEDs (18 pins), [8] Conectors (20 pins), [4] Sensors (16 pins), [7] PowerManagement (9 pins)
VBUS: [3] TopLevel (U7.40), [7] PowerManagement (6 pins)
VREF: [3] TopLevel (U7.35), [7] PowerManagement (U6.1 VREF.1)
VSYS: [3] TopLevel (R44.2 U7.39), [7] PowerManagement (Q3.2 VSYS.1)
CLK: [3] TopLevel (NT2.2), [8] Conectors (CLK.1 SKT1.5)
CS: [3] TopLevel (NT1.2), [8] Conectors (CS.1 R2.1 SKT1.2)
DET_SW: [3] TopLevel (U7.20), [8] Conectors (C19.2 DT.1 R26.1)
DI: [3] TopLevel (NT3.2), [8] Conectors (DI.1 SKT1.3)
DO: [3] TopLevel (NT4.2), [8] Conectors (DO.1 SKT1.7)
GP0/MB1_TX: [3] TopLevel (U7.1), [8] Conectors (J1.13 TX1.1)
GP1/MB1_RX: [3] TopLevel (U7.2), [8] Conectors (J1.14 RX1.1)
GP2/MB1_PWM: [3] TopLevel (U7.4), [8] Conectors (J1.16 PWM1.1)
GP3/MB1_INT: [3] TopLevel (U7.5), [8] Conectors (INT1.1 J1.15)
GP4/I2C0_SDA: [3] TopLevel (R23.1 SDA.1 U7.6), [5] ButtonsAndLEDs (U4.24), [8] Conectors (DISP1.4 J1.11 J2.11), [4] Sensors (U1.8 U2.1 U5.2)
GP5/I2C0_SCL: [3] TopLevel (R22.1 SCL.1 U7.7), [5] ButtonsAndLEDs (U4.25), [8] Conectors (DISP1.3 J1.12 J2.12), [4] Sensors (U1.5 U2.2 U5.3)
GP6/MB1_RST: [3] TopLevel (U7.9), [8] Conectors (J1.2 RST1.1)
GP7/MB2_PWM: [3] TopLevel (U7.10), [8] Conectors (J2.16 PWM2.1)
GP8/MB2_TX: [3] TopLevel (U7.11), [8] Conectors (J2.13 TX2.1)
GP9/MB2_RX: [3] TopLevel (U7.12), [8] Conectors (J2.14 RX2.1)
GP10/MOT_CSn: [3] TopLevel (U7.14), [4] Sensors (ICS.1 U3.12)
GP11/SX_INTn: [3] TopLevel (U7.15), [5] ButtonsAndLEDs (R36.1 SINT.1 U4.9)
GP12/ICM_INT1: [3] TopLevel (U7.16), [4] Sensors (IINT.1 R21.2 U3.4)
GP13/OPT_INT: [3] TopLevel (U7.17), [4] Sensors (OINT.1 R12.2 U1.7)
GP14/MB1_CS: [3] TopLevel (U7.19), [8] Conectors (J1.3)
GP16/SPI0_RX: [3] TopLevel (5 pins), [4] Sensors (U3.1)
GP18/SPI0_SCK: [3] TopLevel (NT2.1 SCK.1 U7.24), [8] Conectors (J1.4 J2.4), [4] Sensors (U3.13)
GP19/SPI0_TX: [3] TopLevel (5 pins), [4] Sensors (U3.14)
GP20/MB2_RST: [3] TopLevel (U7.26), [8] Conectors (J2.2 RST2.1)
GP21/MB2_INT: [3] TopLevel (U7.27), [8] Conectors (INT2.1 J2.15)
GP22/MB2_CS: [3] TopLevel (U7.29), [8] Conectors (J2.3)
GP26/MB1_ADC: [3] TopLevel (U7.31), [8] Conectors (AN1.1 J1.1)
GP27/MB2_ADC: [3] TopLevel (U7.32), [8] Conectors (AN2.1 J2.1)
LED_B: [5] ButtonsAndLEDs (U4.8), Buttons & LEDs/"RGB_LEDs"1 (R17A.2)
LED_B: [5] ButtonsAndLEDs (U4.15), Buttons & LEDs/"RGB_LEDs"2 (R17B.2)
LED_B: [5] ButtonsAndLEDs (U4.22), Buttons & LEDs/"RGB_LEDs"3 (R17C.2)
LED_G: [5] ButtonsAndLEDs (U4.7), Buttons & LEDs/"RGB_LEDs"1 (R16A.2)
LED_G: [5] ButtonsAndLEDs (U4.14), Buttons & LEDs/"RGB_LEDs"2 (R16B.2)
LED_G: [5] ButtonsAndLEDs (U4.21), Buttons & LEDs/"RGB_LEDs"3 (R16C.2)
LED_R: [5] ButtonsAndLEDs (U4.6), Buttons & LEDs/"RGB_LEDs"1 (R15A.2)
LED_R: [5] ButtonsAndLEDs (U4.13), Buttons & LEDs/"RGB_LEDs"2 (R15B.2)
LED_R: [5] ButtonsAndLEDs (U4.20), Buttons & LEDs/"RGB_LEDs"3 (R15C.2)
MB1_MISO: [3] TopLevel (R5.2 R6.2), [8] Conectors (J1.5 J2.5)
MB1_MOSI: [3] TopLevel (R7.2 R9.2), [8] Conectors (J1.6 J2.6)
MIC_OUT: [3] TopLevel (P1.3), [4] Sensors (5 pins)

## Assembly variants
Fabrication: not fitted DISP1 J1 J2 J4 J5 J6 J7 J8 J9 M1 M2 M3 M4 M5 M6 M7 M8 M9 M10 M11 M12 R6 R7 R19 R20 R24